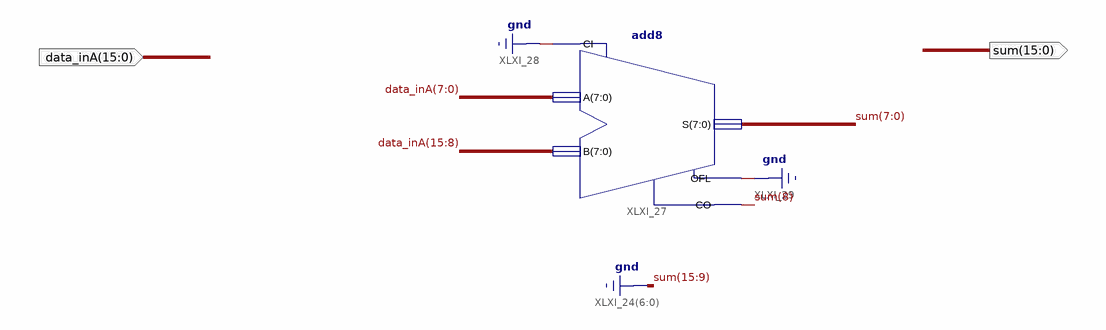
[diagram p0: schematic sheet 1]
// Xilinx ISE schematic Adder.sch (spartan6) as structural Verilog: 1 symbols, 2 ports
module Adder (
  input  [15:0] data_inA,
  output [15:0] sum
);

  add8 XLXI_27 (.A(data_inA[7:0]), .B(data_inA[15:8]), .CI(1'b0), .CO(sum[8]), .OFL(1'b0), .S(sum[7:0]));

  assign sum[15:9] = {7{1'b0}};
endmodule
